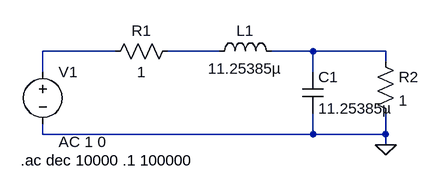
[diagram p0: schematic PassiveSchem.asc]
PassiveSchem.asc, the LTspice schematic file:
Version 4
SHEET 1 880 680
WIRE 144 80 32 80
WIRE 304 80 224 80
WIRE 448 80 384 80
WIRE 560 80 448 80
WIRE 560 96 560 80
WIRE 32 112 32 80
WIRE 448 112 448 80
WIRE 32 208 32 192
WIRE 448 208 448 176
WIRE 448 208 32 208
WIRE 560 208 560 176
WIRE 560 208 448 208
WIRE 560 224 560 208
FLAG 560 224 0
SYMBOL voltage 32 96 R0
WINDOW 123 24 124 Left 2
WINDOW 39 0 0 Left 2
SYMATTR InstName V1
SYMATTR Value ""
SYMATTR Value2 AC 1 0
SYMBOL res 128 96 R270
WINDOW 0 32 56 VTop 2
WINDOW 3 0 56 VBottom 2
SYMATTR InstName R1
SYMATTR Value 1
SYMBOL ind 288 96 R270
WINDOW 0 32 56 VTop 2
WINDOW 3 5 56 VBottom 2
SYMATTR InstName L1
SYMATTR Value 11.25385µ
SYMBOL cap 432 112 R0
SYMATTR InstName C1
SYMATTR Value 11.25385µ
SYMBOL res 544 80 R0
SYMATTR InstName R2
SYMATTR Value 1
TEXT -2 248 Left 2 !.ac dec 10000 .1 100000

The netlist it stands for:
* PassiveSchem.asc
V1 N001 0 AC 1 0
R1 N001 N002 1
L1 N002 N003 11.25385µ
C1 N003 0 11.25385µ
R2 N003 0 1
.ac dec 10000 .1 100000
.backanno
.end